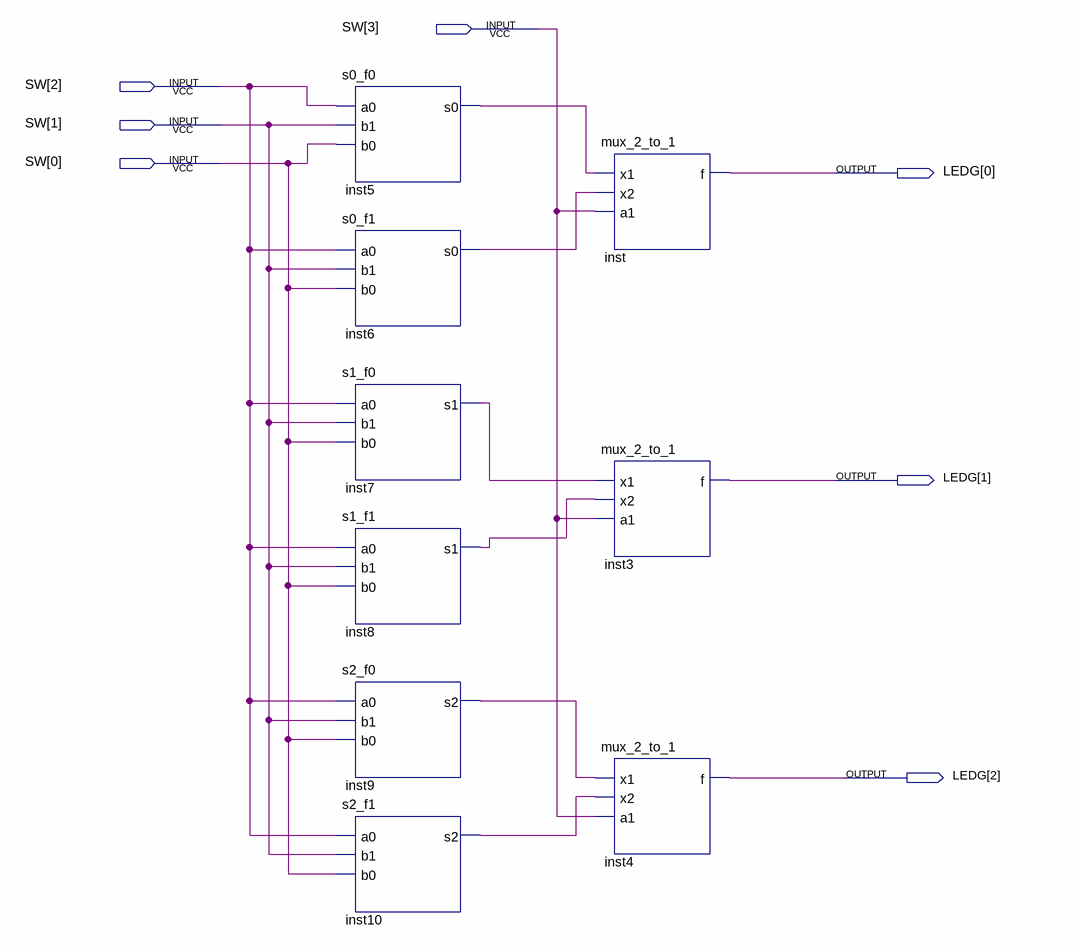
[diagram p0: schematic sheet]
// Quartus schematic Lab4.bdf as structural Verilog: 9 symbols, 7 pins
module Lab4 (
  input  [3:0] SW,
  output [2:0] LEDG
);

  wire inst5_s0, inst6_s0, inst7_s1, inst8_s1, inst9_s2, inst10_s2;

  s0_f0 inst5 (.a0(SW[2]), .b1(SW[1]), .b0(SW[0]), .s0(inst5_s0));
  s0_f1 inst6 (.a0(SW[2]), .b1(SW[1]), .b0(SW[0]), .s0(inst6_s0));
  s1_f0 inst7 (.a0(SW[2]), .b1(SW[1]), .b0(SW[0]), .s1(inst7_s1));
  s1_f1 inst8 (.a0(SW[2]), .b1(SW[1]), .b0(SW[0]), .s1(inst8_s1));
  s2_f0 inst9 (.a0(SW[2]), .b1(SW[1]), .b0(SW[0]), .s2(inst9_s2));
  s2_f1 inst10 (.a0(SW[2]), .b1(SW[1]), .b0(SW[0]), .s2(inst10_s2));
  mux_2_to_1 inst (.x1(inst5_s0), .x2(inst6_s0), .a1(SW[3]), .f(LEDG[0]));
  mux_2_to_1 inst3 (.x1(inst7_s1), .x2(inst8_s1), .a1(SW[3]), .f(LEDG[1]));
  mux_2_to_1 inst4 (.x1(inst9_s2), .x2(inst10_s2), .a1(SW[3]), .f(LEDG[2]));
endmodule
